# EAGLE design PCB-BI8-1x8S (EAGLE 7.1.0)
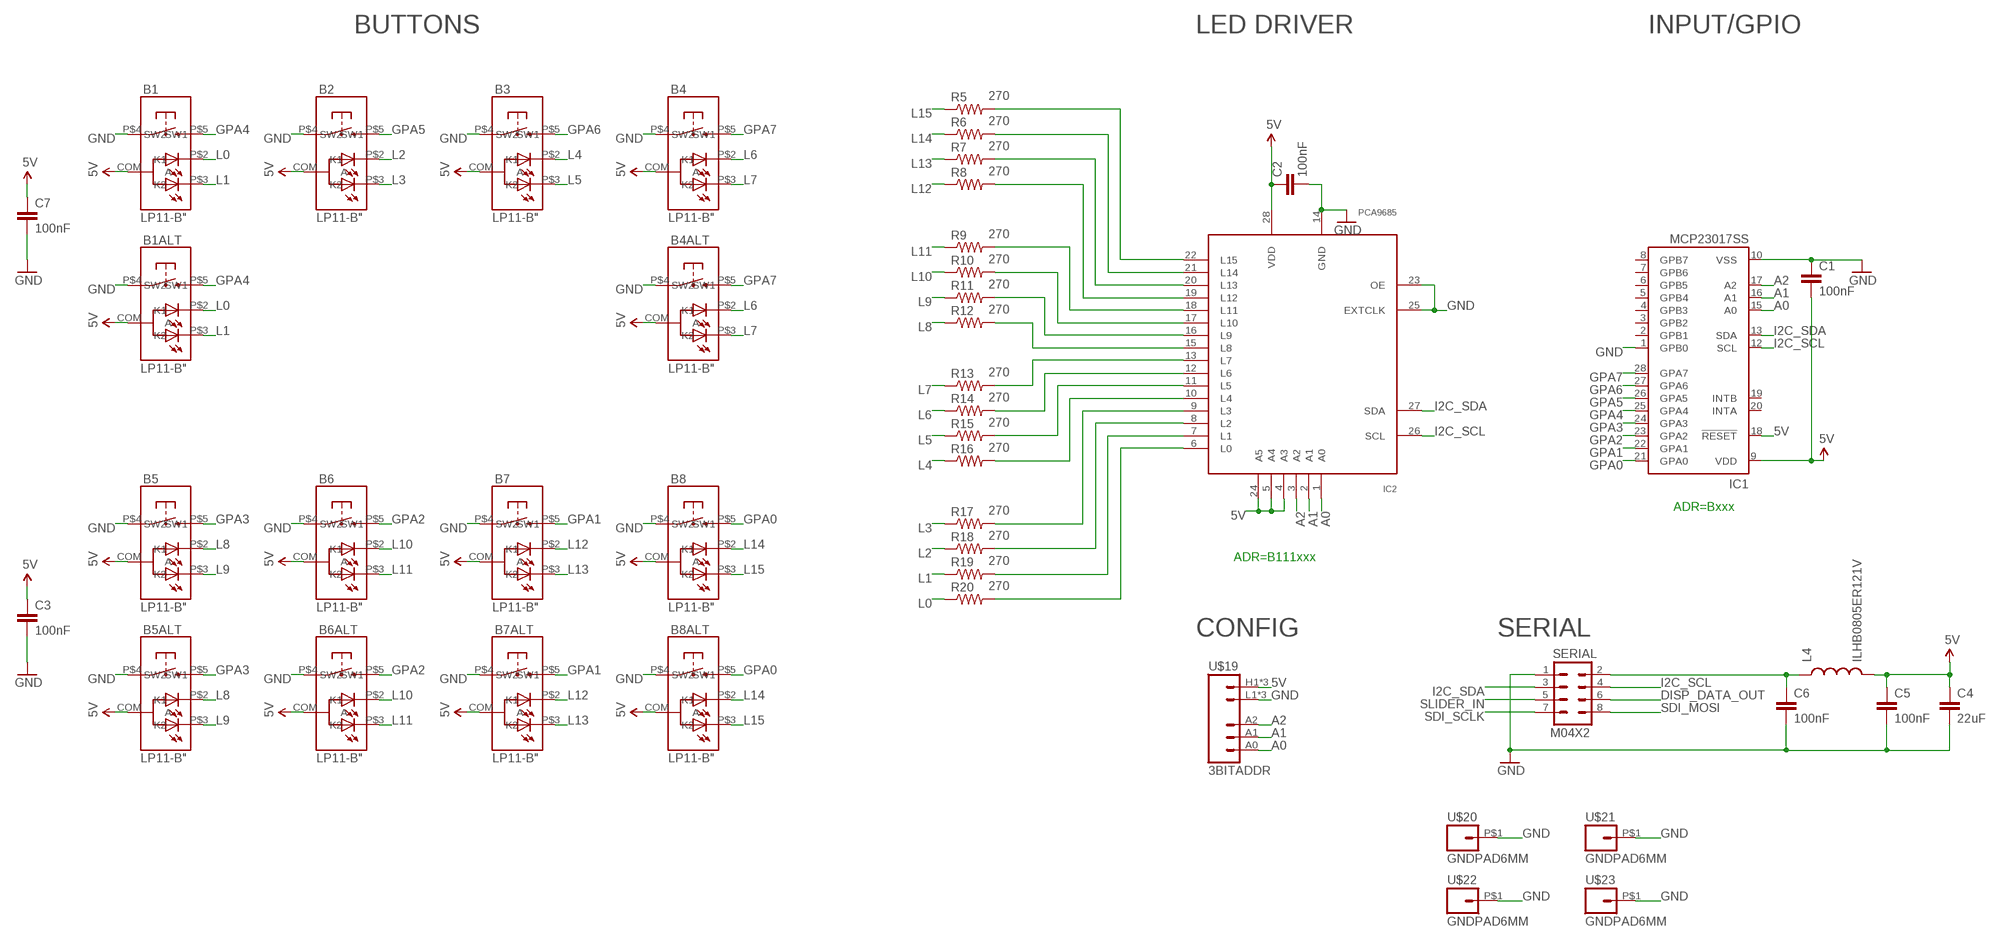
[diagram p0: schematic, sheet 1]

## Parts
B1  LP11-B"  [LP11]
B1ALT  LP11-B"  [LP11]
B2  LP11-B"  [LP11]
B3  LP11-B"  [LP11]
B4  LP11-B"  [LP11]
B4ALT  LP11-B"  [LP11]
B5  LP11-B"  [LP11]
B5ALT  LP11-B"  [LP11]
B6  LP11-B"  [LP11]
B6ALT  LP11-B"  [LP11]
B7  LP11-B"  [LP11]
B7ALT  LP11-B"  [LP11]
B8  LP11-B"  [LP11]
B8ALT  LP11-B"  [LP11]
C1  100nF  CAP0603-CAP  [0603-CAP]
C2  100nF  CAP0603-CAP  [0603-CAP]
C3  100nF  CAP0603-CAP  [0603-CAP]
C4  22uF  CAP0805  [0805]
C5  100nF  CAP0603-CAP  [0603-CAP]
C6  100nF  CAP0603-CAP  [0603-CAP]
C7  100nF  CAP0603-CAP  [0603-CAP]
IC1  MCP23017SS  [SSOP28]
IC2  PCA9685  [TSSOP28]
L4  ILHB0805ER121V  INDUCTOR0805  [0805]
R5  270  RESISTOR0603-RES  [0603-RES]
R6  270  RESISTOR0603-RES  [0603-RES]
R7  270  RESISTOR0603-RES  [0603-RES]
R8  270  RESISTOR0603-RES  [0603-RES]
R9  270  RESISTOR0603-RES  [0603-RES]
R10  270  RESISTOR0603-RES  [0603-RES]
R11  270  RESISTOR0603-RES  [0603-RES]
R12  270  RESISTOR0603-RES  [0603-RES]
R13  270  RESISTOR0603-RES  [0603-RES]
R14  270  RESISTOR0603-RES  [0603-RES]
R15  270  RESISTOR0603-RES  [0603-RES]
R16  270  RESISTOR0603-RES  [0603-RES]
R17  270  RESISTOR0603-RES  [0603-RES]
R18  270  RESISTOR0603-RES  [0603-RES]
R19  270  RESISTOR0603-RES  [0603-RES]
R20  270  RESISTOR0603-RES  [0603-RES]
SERIAL  M04X2  [2X4]
U$19  3BITADDR  [3BITADDR]
U$20  GNDPAD6MM  [3.2MMPAD6MM]
U$21  GNDPAD6MM  [3.2MMPAD6MM]
U$22  GNDPAD6MM  [3.2MMPAD6MM]
U$23  GNDPAD6MM  [3.2MMPAD6MM]

## Nets
5V [Power]: B1.COM(A) B1ALT.COM(A) B2.COM(A) B3.COM(A) B4.COM(A) B4ALT.COM(A) B5.COM(A) B5ALT.COM(A) B6.COM(A) B6ALT.COM(A) B7.COM(A) B7ALT.COM(A) B8.COM(A) B8ALT.COM(A) C1.2 C2.1 C3.1 C4.1 C5.1 C7.1 IC1.9(VDD) IC1.18(!RESET) IC2.4(A3) IC2.5(A4) IC2.24(A5) IC2.28(VDD) L4.2 U$19.H1(VCC) U$19.H2(VCC) U$19.H3(VCC)
A0: IC1.15(A0) IC2.1(A0) U$19.A0
A1: IC1.16(A1) IC2.2(A1) U$19.A1
A2: IC1.17(A2) IC2.3(A2) U$19.A2
DISP_DATA_OUT: SERIAL.6
GND [Power]: B1.P$4(SW1) B1ALT.P$4(SW1) B2.P$4(SW1) B3.P$4(SW1) B4.P$4(SW1) B4ALT.P$4(SW1) B5.P$4(SW1) B5ALT.P$4(SW1) B6.P$4(SW1) B6ALT.P$4(SW1) B7.P$4(SW1) B7ALT.P$4(SW1) B8.P$4(SW1) B8ALT.P$4(SW1) C1.1 C2.2 C3.2 C4.2 C5.2 C6.2 C7.2 IC1.1(GPB0) IC1.10(VSS) IC2.14(GND) IC2.23(OE) IC2.25(EXTCLK) SERIAL.1 U$19.L1(GND) U$19.L2(GND) U$19.L3(GND) U$20.P$1 U$21.P$1 U$22.P$1 U$23.P$1
GPA0: B8.P$5(SW2) B8ALT.P$5(SW2) IC1.21(GPA0)
GPA1: B7.P$5(SW2) B7ALT.P$5(SW2) IC1.22(GPA1)
GPA2: B6.P$5(SW2) B6ALT.P$5(SW2) IC1.23(GPA2)
GPA3: B5.P$5(SW2) B5ALT.P$5(SW2) IC1.24(GPA3)
GPA4: B1.P$5(SW2) B1ALT.P$5(SW2) IC1.25(GPA4)
GPA5: B2.P$5(SW2) IC1.26(GPA5)
GPA6: B3.P$5(SW2) IC1.27(GPA6)
GPA7: B4.P$5(SW2) B4ALT.P$5(SW2) IC1.28(GPA7)
I2C_SCL: IC1.12(SCL) IC2.26(SCL) SERIAL.4
I2C_SDA: IC1.13(SDA) IC2.27(SDA) SERIAL.3
L0: B1.P$2(K1) B1ALT.P$2(K1) R20.1
L1: B1.P$3(K2) B1ALT.P$3(K2) R19.1
L2: B2.P$2(K1) R18.1
L3: B2.P$3(K2) R17.1
L4: B3.P$2(K1) R16.1
L5: B3.P$3(K2) R15.1
L6: B4.P$2(K1) B4ALT.P$2(K1) R14.1
L7: B4.P$3(K2) B4ALT.P$3(K2) R13.1
L8: B5.P$2(K1) B5ALT.P$2(K1) R12.1
L9: B5.P$3(K2) B5ALT.P$3(K2) R11.1
L10: B6.P$2(K1) B6ALT.P$2(K1) R10.1
L11: B6.P$3(K2) B6ALT.P$3(K2) R9.1
L12: B7.P$2(K1) B7ALT.P$2(K1) R8.1
L13: B7.P$3(K2) B7ALT.P$3(K2) R7.1
L14: B8.P$2(K1) B8ALT.P$2(K1) R6.1
L15: B8.P$3(K2) B8ALT.P$3(K2) R5.1
N$1 [Power]: C6.1 L4.1 SERIAL.2
N$4: IC2.13(L7) R13.2
N$5: IC2.12(L6) R14.2
N$7: IC2.11(L5) R15.2
N$9: IC2.10(L4) R16.2
N$10: IC2.9(L3) R17.2
N$11: IC2.8(L2) R18.2
N$12: IC2.7(L1) R19.2
N$19: IC2.6(L0) R20.2
N$20: IC2.15(L8) R12.2
N$21: IC2.16(L9) R11.2
N$22: IC2.17(L10) R10.2
N$23: IC2.18(L11) R9.2
N$24: IC2.19(L12) R8.2
N$25: IC2.20(L13) R7.2
N$26: IC2.21(L14) R6.2
N$27: IC2.22(L15) R5.2
SDI_MOSI: SERIAL.8
SDI_SCLK: SERIAL.7
SLIDER_IN: SERIAL.5
Unconnected: IC1.2(GPB1) IC1.3(GPB2) IC1.4(GPB3) IC1.5(GPB4) IC1.6(GPB5) IC1.7(GPB6) IC1.8(GPB7) IC1.19(INTB) IC1.20(INTA)

## Notes on the sheet
- BUTTONS | LED DRIVER | INPUT/GPIO
- ADR=Bxxx
- ADR=B111xxx
- CONFIG | SERIAL

## Library data of the parts
B1 B1ALT B2-B4 B4ALT B5 B5ALT B6 B6ALT B7 B7ALT B8 B8ALT = SKAARHOJ:LP11-B
C1-C7 = SparkFun:CAP: Capacitor Standard 0603 ceramic capacitor, and 0.1" leaded capacitor.
IC1 = microchip:MCP23017: http://ww1.microchip.com/downloads/en/DeviceDoc/21952a.pdf Source: http://ww1.microchip.com/downloads/en/DeviceDoc/21952a.pdf; MF: MICROCHIP; MPN: MCP23017-E/SS; OC_FARNELL: 1467674; OC_NEWARK: 31K2960
IC2 = wsmith:PCA9685
L4 = SparkFun:INDUCTOR: Inductors Basic Inductor/Choke - 0603 and 1206. Footprints are not proven and vary greatly between part numbers.
R5-R20 = SparkFun:RESISTOR: Resistor Basic schematic elements and footprints for 0603, 1206, and PTH resistors.
SERIAL = SparkFun:M04X2
U$19 = SKAARHOJ:3BITADDR
U$20-U$23 = SKAARHOJ:GNDPAD

## Net classes
0 default: width 0.203 mm, drill 0.305 mm, clearance 0.203 mm
1 Power: width 0.305 mm, drill 0.61 mm, clearance 0.203 mm

## Board
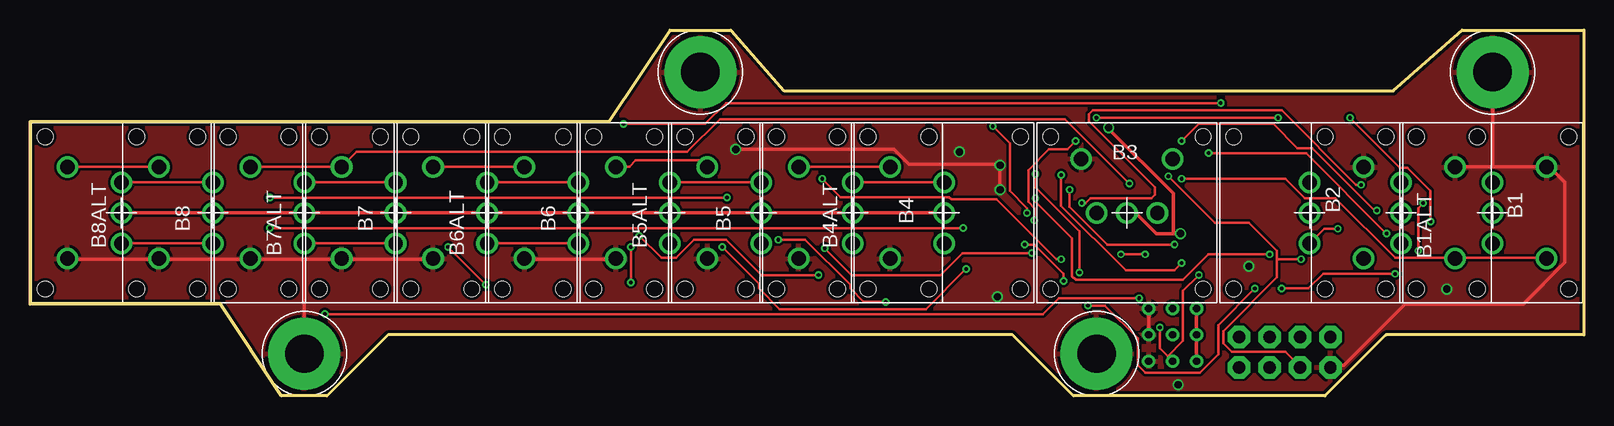
[diagram p1: board, top side]
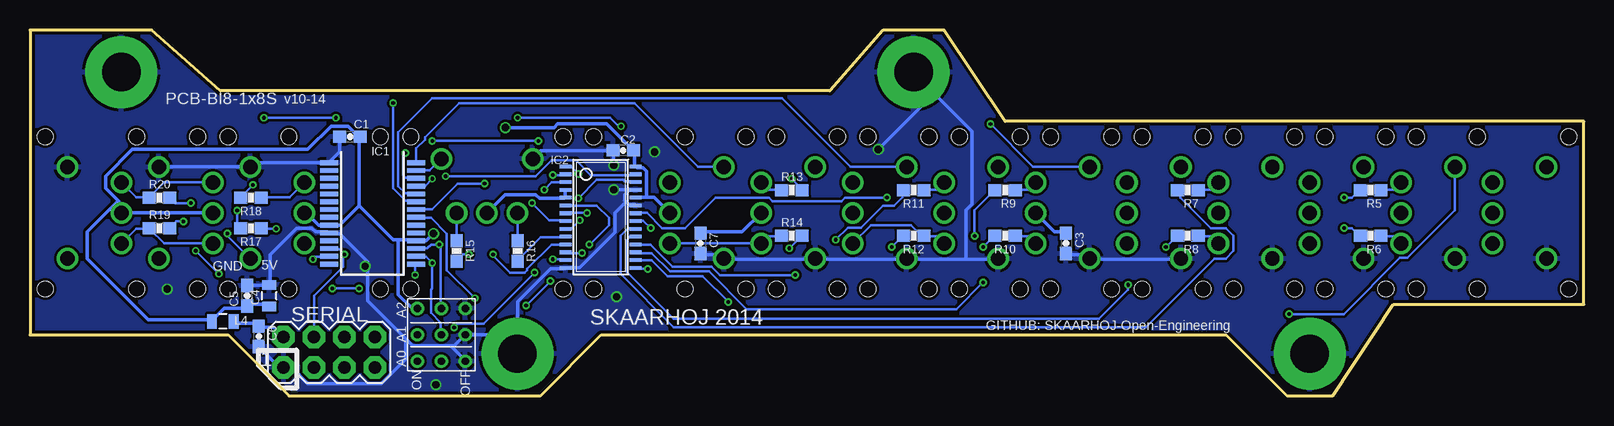
[diagram p2: board, bottom side, seen from below]

Size 129.54 x 30.48 mm. Coordinates in mm from the lower left corner, seen from the top.
Outline: 0,22.86 48.26,22.86 53.34,30.48 58.42,30.48 62.87,25.4 113.67,25.4 119.38,30.48 129.54,30.48 129.54,5.08 113.03,5.08 107.95,0 87,0 81.92,5.08 29.84,5.08 24.77,0 20.95,0 15.88,7.62 0,7.62 0,22.86
Copper layers (1*16): Top 0.035mm / dielectric 1.5mm / Bottom 0.035mm
Design rules "Fusion_eagle_rule_v1.1": minimum track width 6mil, minimum drill 12mil, track to track 6mil, track to pad 6mil, pad to pad 6mil, via to via 6mil, smd to smd 0mil, copper to edge 10mil, drill to drill 10mil, minimum pad ring 10mil, minimum via ring 6mil, stop-mask expansion 2mil, vias tented up to drill 100mil, thermal gap 10mil

### Footprints (pad centres in the part's own frame; a part is rotated, then mirrored left to right if it is on the bottom)
LP11 = drill 1.2: COM 0,0; P$2 0,2.54; P$3 0,-2.54; P$4 4.5,3.81; P$5 4.5,-3.81 | hole 1.3: -6.35,6.35; 6.35,6.35; 6.35,-6.35; -6.35,-6.35
0603-CAP = smd 1.1 x 1: 1 -0.85,0; 2 0.85,0
0805 = smd 0.8 x 1.2: 1 -0.9,0; 2 0.9,0
SSOP28 = smd 0.4 x 1.5: 1 -4.225,-3.625; 2 -3.575,-3.625; 3 -2.925,-3.625; 4 -2.275,-3.625; 5 -1.625,-3.625; 6 -0.975,-3.625; 7 -0.325,-3.625; 8 0.325,-3.625; 9 0.975,-3.625; 10 1.625,-3.625; 11 2.275,-3.625; 12 2.925,-3.625; 13 3.575,-3.625; 14 4.225,-3.625; 15 4.225,3.625; 16 3.575,3.625; 17 2.925,3.625; 18 2.275,3.625; 19 1.625,3.625; 20 0.975,3.625; 21 0.325,3.625; 22 -0.325,3.625; 23 -0.975,3.625; 24 -1.625,3.625; 25 -2.275,3.625; 26 -2.925,3.625; 27 -3.575,3.625; 28 -4.225,3.625
TSSOP28 = smd 0.305 x 0.991: 1 -4.225,-2.918; 2 -3.575,-2.918; 3 -2.925,-2.918; 4 -2.275,-2.918; 5 -1.625,-2.918; 6 -0.975,-2.918; 7 -0.325,-2.918; 8 0.325,-2.918; 9 0.975,-2.918; 10 1.625,-2.918; 11 2.275,-2.918; 12 2.925,-2.918; 13 3.575,-2.918; 14 4.225,-2.918; 15 4.225,2.918; 16 3.575,2.918; 17 2.925,2.918; 18 2.275,2.918; 19 1.625,2.918; 20 0.975,2.918; 21 0.325,2.918; 22 -0.325,2.918; 23 -0.975,2.918; 24 -1.625,2.918; 25 -2.275,2.918; 26 -2.925,2.918; 27 -3.575,2.918; 28 -4.225,2.918
0603-RES = smd 1.1 x 1: 1 -0.85,0; 2 0.85,0
2X4 = drill 1.016 pad 1.88 octagon: 1 -3.81,-1.27; 2 -3.81,1.27; 3 -1.27,-1.27; 4 -1.27,1.27; 5 1.27,-1.27; 6 1.27,1.27; 7 3.81,-1.27; 8 3.81,1.27
3BITADDR = drill 0.6: A0 -2.2,0; A1 0,0; A2 2.2,0; H1 -2.2,2; H2 0,2; H3 2.2,2; L1 -2.2,-2; L2 0,-2; L3 2.2,-2
3.2MMPAD6MM = drill 3.2 pad 6: P$1 0,0

### Placement (x,y rotation side)
B1  121.92,15.24 0 top
B1ALT  114.3,15.24 0 top
B2  106.68,15.24 0 top
B3  91.44,15.24 90 top
B4  76.2,15.24 180 top
B4ALT  68.58,15.24 180 top
B5  60.96,15.24 180 top
B5ALT  53.34,15.24 180 top
B6  45.72,15.24 180 top
B6ALT  38.1,15.24 180 top
B7  30.48,15.24 180 top
B7ALT  22.86,15.24 180 top
B8  15.24,15.24 180 top
B8ALT  7.62,15.24 180 top
C1  102.87,21.59 0 bottom
C2  80.09,20.45 180 bottom
C3  43.18,12.7 270 bottom
C4  109.6,8.33 90 bottom
C5  111.43,8.33 90 bottom
C6  110.46,4.95 270 bottom
C7  73.66,12.7 270 bottom
IC1  100.99,15.19 270 bottom
IC2  81.97,14.88 270 bottom
L4  113.46,6.2 180 bottom
R5  17.78,17.14 180 bottom
R6  17.78,13.34 180 bottom
R7  33.02,17.14 180 bottom
R8  33.02,13.34 180 bottom
R9  48.26,17.14 180 bottom
R10  48.26,13.34 180 bottom
R11  55.88,17.14 180 bottom
R12  55.88,13.34 180 bottom
R13  66.04,17.14 0 bottom
R14  66.04,13.34 0 bottom
R15  93.98,12.06 270 bottom
R16  88.9,12.06 270 bottom
R17  111.12,13.97 180 bottom
R18  111.12,16.51 180 bottom
R19  118.75,13.97 0 bottom
R20  118.75,16.51 0 bottom
SERIAL  104.6,3.63 0 bottom
U$19  95.25,5.08 90 bottom
U$20  22.86,3.5 0 top
U$21  55.88,26.98 0 top
U$22  121.92,26.98 0 top
U$23  88.9,3.5 0 top

### Tracks (layer width: path | path; a pad name or v marks a point on that pad's centre or on a via)
5V  (via drill 0.61)
  Top 0.305: U$19.H1 97.23,2.95 97.23,5.08 U$19.H2 97.23,5.18 97.23,7.21 U$19.H3 | B3.COM 92.15,15.24 93.88,13.51 95.3,13.51 | v95.91,13.51 95.3,13.51 | B8ALT.COM B8.COM B7ALT.COM B7.COM B6ALT.COM B6.COM B5ALT.COM B5.COM B4ALT.COM B4.COM | 95.3,13.51 95.3,16.87 89.92,22.25 v89.92,22.35
  Bottom 0.305: B1ALT.COM B1.COM 122.02,15.34 122.02,16.05 122.2,16.23 | IC2.4 84.94,17.07 84.94,16.56 IC2.5 85.04,16.46 87.07,16.46 87.38,16.76 89.92,16.76 B3.COM | 102.11,15.85 102.11,21.54 C1.2 102.21,21.64 103.02,22.45 104.44,22.45 106.38,20.52 121.01,20.52 123.24,18.29 123.24,17.27 122.2,16.23 | 102.11,15.85 103.73,14.22 104.55,14.22 IC1.9 104.75,14.22 105.46,14.22 106.48,15.24 B2.COM | 98.86,13.01 99.26,13.01 102.11,15.85 | 98.86,13.01 97.43,13.01 IC1.18 97.23,12.9 96.52,12.9 v95.91,13.51 | 98.86,13.01 98.86,8.43 97.74,7.32 97.33,7.32 U$19.H3 | 78.13,16.56 77.52,16.56 B4.COM | 78.13,16.56 79.05,16.56 IC2.24 | 78.13,16.56 78.13,18.69 78.44,19 78.94,19 IC2.28 79.15,19.2 79.15,20.42 C2.1 79.35,20.52 81.48,22.66 85.55,22.66 85.85,22.35 v89.92,22.35 | C4.1 109.86,7.62 111.12,7.62 C5.1 111.44,7.3 113.35,7.3 114.3,6.35 L4.2 114.62,6.35 119.7,6.35 124.78,11.43 124.78,13.65 122.2,16.23 | B6.COM 44.13,13.65 43.18,13.65 C3.1 | B4ALT.COM 70.17,13.65 73.66,13.65 C7.1
A0  (via drill 0.3)
  Top 0.203: v83.82,18.49 83.82,17.37 87.48,13.72 v87.48,10.26 | v94.18,5.69 94.18,3.96 94.84,3.3 | 94.84,3.3 95.2,2.95 U$19.A0 | v97.43,10.06 96.11,8.74 96.11,4.57 94.84,3.3
  Bottom 0.203: v83.82,18.49 84.43,19.1 84.84,19.1 IC2.1 | v87.48,10.26 91.75,5.99 93.88,5.99 v94.18,5.69 | v97.43,10.06 97.43,10.87 IC1.15
A1  (via drill 0.3)
  Top 0.203: v85.95,18.39 85.95,15.85 91.34,10.46 95.4,10.46 v96.01,11.07
  Bottom 0.203: v85.95,18.39 84.94,18.39 IC2.2 | IC1.16 97.33,11.58 96.52,11.58 v96.01,11.07 96.01,8.94 96.11,8.84 96.11,6.91 95.3,6.1 95.3,5.08 U$19.A1
A2  (via drill 0.3)
  Top 0.203: v86.67,17.17 86.67,15.75 89.81,12.6 v95.4,12.6
  Bottom 0.203: v86.67,17.17 86.06,17.78 84.94,17.78 IC2.3 | IC1.17 97.33,12.29 96.42,12.29 96.11,12.6 v95.4,12.6 95.3,12.5 95.3,7.32 U$19.A2
GND  (via drill 0.6, 0.61)
  Top 0.305: 121.92,19.1 126.39,19.1 B1.P$4 126.68,19.05 127.95,17.78 127.95,11.11 124.46,7.62 114.62,7.62 109.54,2.54 108.58,2.54 SERIAL.1 | 121.92,19.1 118.87,19.1 B1ALT.P$4 | U$22.P$1 121.92,19.1 | U$19.L3 93.27,7.21 93.27,5.08 U$19.L2 | v80.87,17.17 v80.87,19.2 80.77,19.3 73.25,19.3 72.03,20.52 v58.83,20.52 | B6.P$4 41.25,11.38 48.77,11.38 B5ALT.P$4 | B8ALT.P$4 3.15,11.38 10.67,11.38 B8.P$4 10.87,11.38 18.29,11.38 B7ALT.P$4 18.49,11.38 22.86,11.38 | 22.86,11.38 25.91,11.38 B7.P$4 26.11,11.38 33.53,11.38 B6ALT.P$4 | 22.86,11.38 U$20.P$1
  Bottom 0.305: C1.1 103.73,21.54 103.73,20.32 104.55,19.51 IC1.1 104.75,19.41 110.85,19.41 111.15,19.1 B2.P$4 111.25,19.1 118.77,19.1 B1ALT.P$4 | 98.15,4.67 97.64,4.17 94.39,4.17 | 98.15,4.67 101.4,7.92 101.4,11.18 103.73,13.51 104.55,13.51 IC1.10 104.78,13.65 105.73,13.65 106.05,13.97 107.31,13.97 109.54,11.75 109.54,9.53 C4.2 109.86,9.21 111.12,9.21 C5.2 | 94.39,4.17 94.18,4.17 93.27,5.08 U$19.L2 89,5.08 U$23.P$1 88.9,7.82 86.16,10.57 84.94,10.57 IC2.14 84.73,10.67 83.72,10.67 80.77,13.61 80.77,15.24 79.86,16.15 | U$19.L1 93.27,2.95 94.39,4.06 94.39,4.17 | 98.15,4.67 98.25,4.57 98.25,3.05 100.28,1.02 106.38,1.02 107.7,2.34 108.31,2.34 SERIAL.1 108.58,2.22 110.17,3.81 C6.2 | B3.P$4 87.58,19.81 86.97,20.42 80.97,20.42 C2.2 80.87,20.32 v80.87,19.2 | 79.86,16.15 79.96,16.26 79.96,16.76 79.65,17.07 | 79.86,16.15 79.65,15.95 79.15,15.95 IC2.23 | 79.65,17.07 79.55,17.17 79.15,17.17 IC2.25 | v80.87,17.17 79.76,17.17 79.65,17.07 | B6ALT.P$4 33.63,11.38 41.15,11.38 B6.P$4 41.27,11.43 41.59,11.75 43.18,11.75 C3.2 | 51.51,11.38 48.87,11.38 B5ALT.P$4 | 51.51,11.38 56.39,11.38 B5.P$4 56.49,11.38 64.01,11.38 B4ALT.P$4 64.21,11.38 71.63,11.38 B4.P$4 71.75,11.43 72.07,11.75 73.66,11.75 C7.2 | 51.51,11.38 51.51,15.44 51,15.95 51,22.05 55.88,26.92 U$21.P$1 54.25,25.09 v58.83,20.52
  other vias: 118.11,8.89 101.6,10.79 95.71,0.91 80.64,8.26 77.47,20.32
  pour Top: 0,0 129.54,0 129.54,30.48 0,30.48
  pour Bottom: 0,0 129.54,0 129.54,30.48 0,30.48
GPA0  (via drill 0.3)
  Top 0.203: v92.46,8.13 85.75,8.13 84.43,6.81 v24.59,6.81 | B8ALT.P$5 3.15,19.1 10.67,19.1 B8.P$5
  Bottom 0.203: v92.46,8.13 94.79,10.46 94.79,13.51 96.11,14.83 97.33,14.83 IC1.21 | v24.59,6.81 20.02,6.81 15.34,11.48 14.73,11.48 10.77,15.44 10.77,19 B8.P$5
GPA1  (via drill 0.3)
  Top 0.203: v91.64,17.68 86.26,23.06 57.51,23.06 54.76,20.32 27.23,20.32 26.01,19.1 B7.P$5 25.91,19.1 18.39,19.1 B7ALT.P$5
  Bottom 0.203: v91.64,17.68 93.88,17.68 96.01,15.54 97.33,15.54 IC1.22
GPA2  (via drill 0.3)
  Top 0.203: v99.26,24.38 58.01,24.38 56.29,22.66 v49.48,22.66 | B6ALT.P$5 33.63,19.1 41.15,19.1 B6.P$5
  Bottom 0.203: v99.26,24.38 99.26,17.27 98.25,16.26 97.43,16.26 IC1.23 | v49.48,22.66 45.92,19.1 41.25,19.1 B6.P$5
GPA3
  Top 0.203: B5ALT.P$5 48.87,19.1 49.99,19.1 50.49,19.61 55.88,19.61 56.39,19.1 B5.P$5
  Bottom 0.203: IC1.24 97.43,16.87 98.25,16.87 98.86,17.48 98.86,21.95 96.01,24.79 66.85,24.79 61.16,19.1 56.49,19.1 B5.P$5
GPA4  (via drill 0.3)
  Top 0.203: v96.01,18.09 104.65,18.09 106.27,16.46 108.81,16.46 113.79,11.48 118.77,11.48 B1ALT.P$5 118.87,11.48 126.39,11.48 B1.P$5
  Bottom 0.203: v96.01,18.09 96.62,17.48 97.33,17.48 IC1.25
GPA5  (via drill 0.3)
  Top 0.203: v98.25,20.22 106.38,20.22 v113.08,13.51
  Bottom 0.203: v98.25,20.22 98.45,20.02 98.45,18.39 98.25,18.19 97.43,18.19 IC1.26 | v113.08,13.51 113.08,13.31 111.25,11.48 B2.P$5
GPA6
  Bottom 0.203: IC1.27 97.33,18.8 96.22,18.8 95.3,19.71 B3.P$5
GPA7
  Top 0.203: B4ALT.P$5 64.11,19.1 71.63,19.1 B4.P$5
  Bottom 0.203: IC1.28 97.33,19.51 97.33,20.62 96.62,21.34 96.62,21.54 93.78,24.38 79.15,24.38 73.86,19.1 71.73,19.1 B4.P$5
I2C_SCL  (via drill 0.3)
  Top 0.203: v83.82,16.46 83.82,16.15 86.87,13.11 86.87,9.96 87.17,9.65 96.11,9.65 98.25,11.79 v103.33,11.79
  Bottom 0.203: v83.82,16.46 82.3,17.98 80.06,17.98 79.96,17.88 79.15,17.88 IC2.26 | IC1.12 104.55,12.19 103.73,12.19 v103.33,11.79 103.43,11.79 103.43,10.77 105.87,8.33 SERIAL.4
I2C_SDA  (via drill 0.3)
  Top 0.203: v94.89,18.29 98.75,14.43 101.6,14.43 103.94,12.09 103.94,11.38 | 103.94,11.38 103.94,9.86 99.47,5.38 99.47,4.37 100.18,3.66 104.65,3.66 105.87,2.44 SERIAL.3 | 103.94,11.38 v105.97,11.38
  Bottom 0.203: v94.89,18.29 87.38,18.29 86.06,19.61 84.02,19.61 82.8,18.39 79.15,18.39 IC2.27 | v105.97,11.38 105.77,11.58 104.65,11.58 IC1.13
L0
  Bottom 0.203: B1.P$2 120.7,16.56 119.69,16.56 R20.1 119.58,16.56 118.36,17.78 B1ALT.P$2
L1
  Bottom 0.203: B1.P$3 120.7,13.92 119.69,13.92 R19.1 119.58,13.92 118.36,12.7 B1ALT.P$3
L2
  Bottom 0.203: B2.P$2 107.9,16.56 110.24,16.56 R18.1
L3  (via drill 0.3)
  Top 0.203: v109.02,13.92 107.9,13.92 B2.P$3
  Bottom 0.203: v109.02,13.92 110.24,13.92 R17.1
L4
  Bottom 0.203: B3.P$2 R16.1
L5
  Bottom 0.203: B3.P$3 R15.1
L6
  Bottom 0.203: R14.1 66.95,13.31 67.97,13.31 B4ALT.P$2 B4.P$2
L7
  Top 0.203: B4.P$3 B4ALT.P$3
  Bottom 0.203: B4ALT.P$3 67.97,17.17 66.95,17.17 R13.1
L8
  Bottom 0.203: B5ALT.P$2 53.95,13.31 54.97,13.31 R12.1 55.07,13.41 55.27,13.41 56.08,14.22 59.44,14.22 B5.P$2
L9
  Top 0.203: B5.P$3 B5ALT.P$3
  Bottom 0.203: B5ALT.P$3 53.95,17.17 54.97,17.17 R11.1
L10
  Top 0.203: B6.P$2 B6ALT.P$2
  Bottom 0.203: B6.P$2 46.33,13.31 47.35,13.31 R10.1
L11
  Top 0.203: B6.P$3 B6ALT.P$3
  Bottom 0.203: B6.P$3 46.33,17.17 47.35,17.17 R9.1
L12
  Top 0.203: B7.P$2 B7ALT.P$2
  Bottom 0.203: B7.P$2 31.09,13.31 32.11,13.31 R8.1
L13
  Top 0.203: B7.P$3 B7ALT.P$3
  Bottom 0.203: B7.P$3 31.09,17.17 32.11,17.17 R7.1
L14
  Top 0.203: B8.P$2 B8ALT.P$2
  Bottom 0.203: B8.P$2 15.85,13.31 16.87,13.31 R6.1
L15
  Top 0.203: B8.P$3 B8ALT.P$3
  Bottom 0.203: B8.P$3 15.85,17.17 16.87,17.17 R5.1
N$1
  Bottom 0.305: L4.1 112.39,6.03 110.49,6.03 C6.1 110.17,5.71 109.22,5.71 SERIAL.2
N$4  (via drill 0.3)
  Top 0.203: v85.95,11.38 85.55,11.38 80.57,16.36 76.81,16.36 76.61,16.56 67.56,16.56 v66.04,18.09
  Bottom 0.203: v85.95,11.38 84.94,11.38 IC2.13 | v66.04,18.09 65.13,17.17 R13.2
N$5  (via drill 0.3)
  Top 0.203: v83.52,11.89 77.72,11.89 75.89,10.06 68.48,10.06 v66.24,12.29
  Bottom 0.203: v83.52,11.89 84.84,11.89 IC2.12 | v66.24,12.29 65.23,13.31 R14.2
N$7  (via drill 0.3)
  Top 0.203: v92.96,11.79 v90.93,11.79
  Bottom 0.203: v90.93,11.79 90.93,11.68 89.51,10.26 88.29,10.26 88.09,10.46 88.09,10.57 86.06,12.6 84.94,12.6 IC2.11 | v92.96,11.79 93.47,11.79 93.98,11.28 R15.2
N$9
  Bottom 0.203: IC2.10 84.94,13.21 86.97,13.21 88.9,11.28 R16.2
N$10  (via drill 0.3)
  Top 0.203: v83.72,14.63 83.72,15.65 83.21,16.15 83.21,18.8 84.94,20.52 86.46,20.52 v87.17,21.23 | v96.01,21.23 97.43,22.66 103.63,22.66 105.66,20.62 106.88,20.62 112.06,15.44 v112.27,15.44
  Bottom 0.203: v83.72,14.63 84.43,13.92 84.84,13.92 IC2.9 | v96.01,21.23 v87.17,21.23 | v112.27,15.44 112.27,14.22 112.06,14.02 R17.2
N$11  (via drill 0.3)
  Top 0.203: v87.68,16.05 87.99,16.05 88.39,16.46 93.47,16.46 93.78,16.76 93.78,17.37 88.29,22.86 88.29,23.47 88.59,23.77 104.34,23.77 110.54,17.58 v110.95,17.58
  Bottom 0.203: v87.68,16.05 86.26,14.63 84.94,14.63 IC2.8 | v110.95,17.58 111.96,16.56 R18.2
N$12  (via drill 0.3)
  Top 0.203: v83.11,15.24 83.11,15.65 81.69,17.07 81.69,21.03 v80.26,22.45 | v104.04,23.16 v88.9,23.16 | v110.03,23.16 114.2,19 114.81,19 116.74,17.07 v116.74,14.53
  Bottom 0.203: v83.11,15.24 84.84,15.24 IC2.7 | v80.26,22.45 80.47,22.45 81.18,23.16 v88.9,23.16 | v110.03,23.16 v104.04,23.16 | v116.74,14.53 117.35,14.53 117.86,14.02 R19.2
N$19  (via drill 0.3)
  Top 0.203: v82.91,12.6 83.72,12.6 86.16,10.16 v86.16,9.55 | v88.19,7.52 89.61,7.52 92.35,4.78 92.35,2.54 92.96,1.93 97.54,1.93 99.06,3.45 99.06,5.89 v102.11,8.94 | v104.34,8.94 106.58,8.94 107.8,10.16 v113.79,10.16 | v115.72,12.09 115.72,15.65 v116.13,16.05
  Bottom 0.203: v82.91,12.6 81.28,14.22 81.28,14.83 82.3,15.85 84.84,15.85 IC2.6 | v88.19,7.52 v86.16,9.55 | v104.34,8.94 v102.11,8.94 | v115.72,12.09 v113.79,10.16 | v116.13,16.05 117.45,16.05 117.86,16.46 R20.2
N$20  (via drill 0.3)
  Top 0.203: v78.03,10.57 74.68,7.21 62.48,7.21 60.76,8.94 60.76,9.35 v57.71,12.39
  Bottom 0.203: v78.03,10.57 79.05,10.57 IC2.15 | v57.71,12.39 56.79,13.31 R12.2
N$21  (via drill 0.3)
  Top 0.203: v71.32,7.82 69.49,7.82 68.38,8.94 68.38,9.25 64.62,13.01 v62.38,13.01
  Bottom 0.203: v71.32,7.82 73.46,9.96 76.4,9.96 77.72,11.28 79.05,11.28 IC2.16 | v62.38,13.01 61.37,14.02 60.25,14.02 58.42,15.85 57.51,15.85 56.79,16.56 56.79,17.07 R11.2
N$22  (via drill 0.3)
  Top 0.203: v50.09,12.39 v50.09,9.45
  Bottom 0.203: v50.09,9.45 52.32,7.21 69.8,7.21 72.95,10.36 76.2,10.36 77.72,11.89 79.05,11.89 IC2.17 | v50.09,12.39 49.17,13.31 R10.2
N$23  (via drill 0.3)
  Top 0.203: v65.73,10.06 60.96,10.06 58.01,13.01 55.37,13.01 53.85,11.48 52.63,11.48 v50.8,13.31
  Bottom 0.203: v65.73,10.06 72.03,10.06 72.75,10.77 76,10.77 77.83,12.6 79.05,12.6 IC2.18 | v50.8,13.31 50.8,15.44 49.17,17.07 R9.2
N$24  (via drill 0.3)
  Top 0.203: v34.85,12.39 v38,9.25
  Bottom 0.203: v38,9.25 38,8.84 40.44,6.4 75.89,6.4 79.86,10.36 79.86,12.9 79.55,13.21 79.15,13.21 IC2.19 | v34.85,12.39 33.93,13.31 R8.2
N$25
  Bottom 0.203: IC2.20 79.06,13.97 79.69,13.97 80.33,13.34 80.33,10.16 75.88,5.71 36.51,5.71 30.8,11.43 29.84,11.43 29.21,12.06 29.21,13.34 29.84,13.97 31.11,13.97 33.66,16.51 33.66,17.14 R7.2
N$26  (via drill 0.3)
  Top 0.203: v20,13.97 v77.79,13.97
  Bottom 0.203: v77.79,13.97 78.42,14.61 78.74,14.61 IC2.21 | v20,13.97 19.37,13.97 18.73,13.34 R6.2
N$27  (via drill 0.3)
  Top 0.203: v20,16.51 v58.1,16.51
  Bottom 0.203: v58.1,16.51 61.59,16.51 61.91,16.19 67.63,16.19 67.94,16.51 72.39,16.51 74.93,13.97 76.83,13.97 78.11,15.24 78.74,15.24 IC2.22 | v20,16.51 19.37,16.51 18.73,17.14 R5.2

### Text on the board
_bsilk: v10-14 | PCB-BI8-1x8S | GND | 5V | SKAARHOJ 2014 | GITHUB: SKAARHOJ-Open-Engineering | 1